# Altium schematic sheet LED1_2.SchDoc
size A2
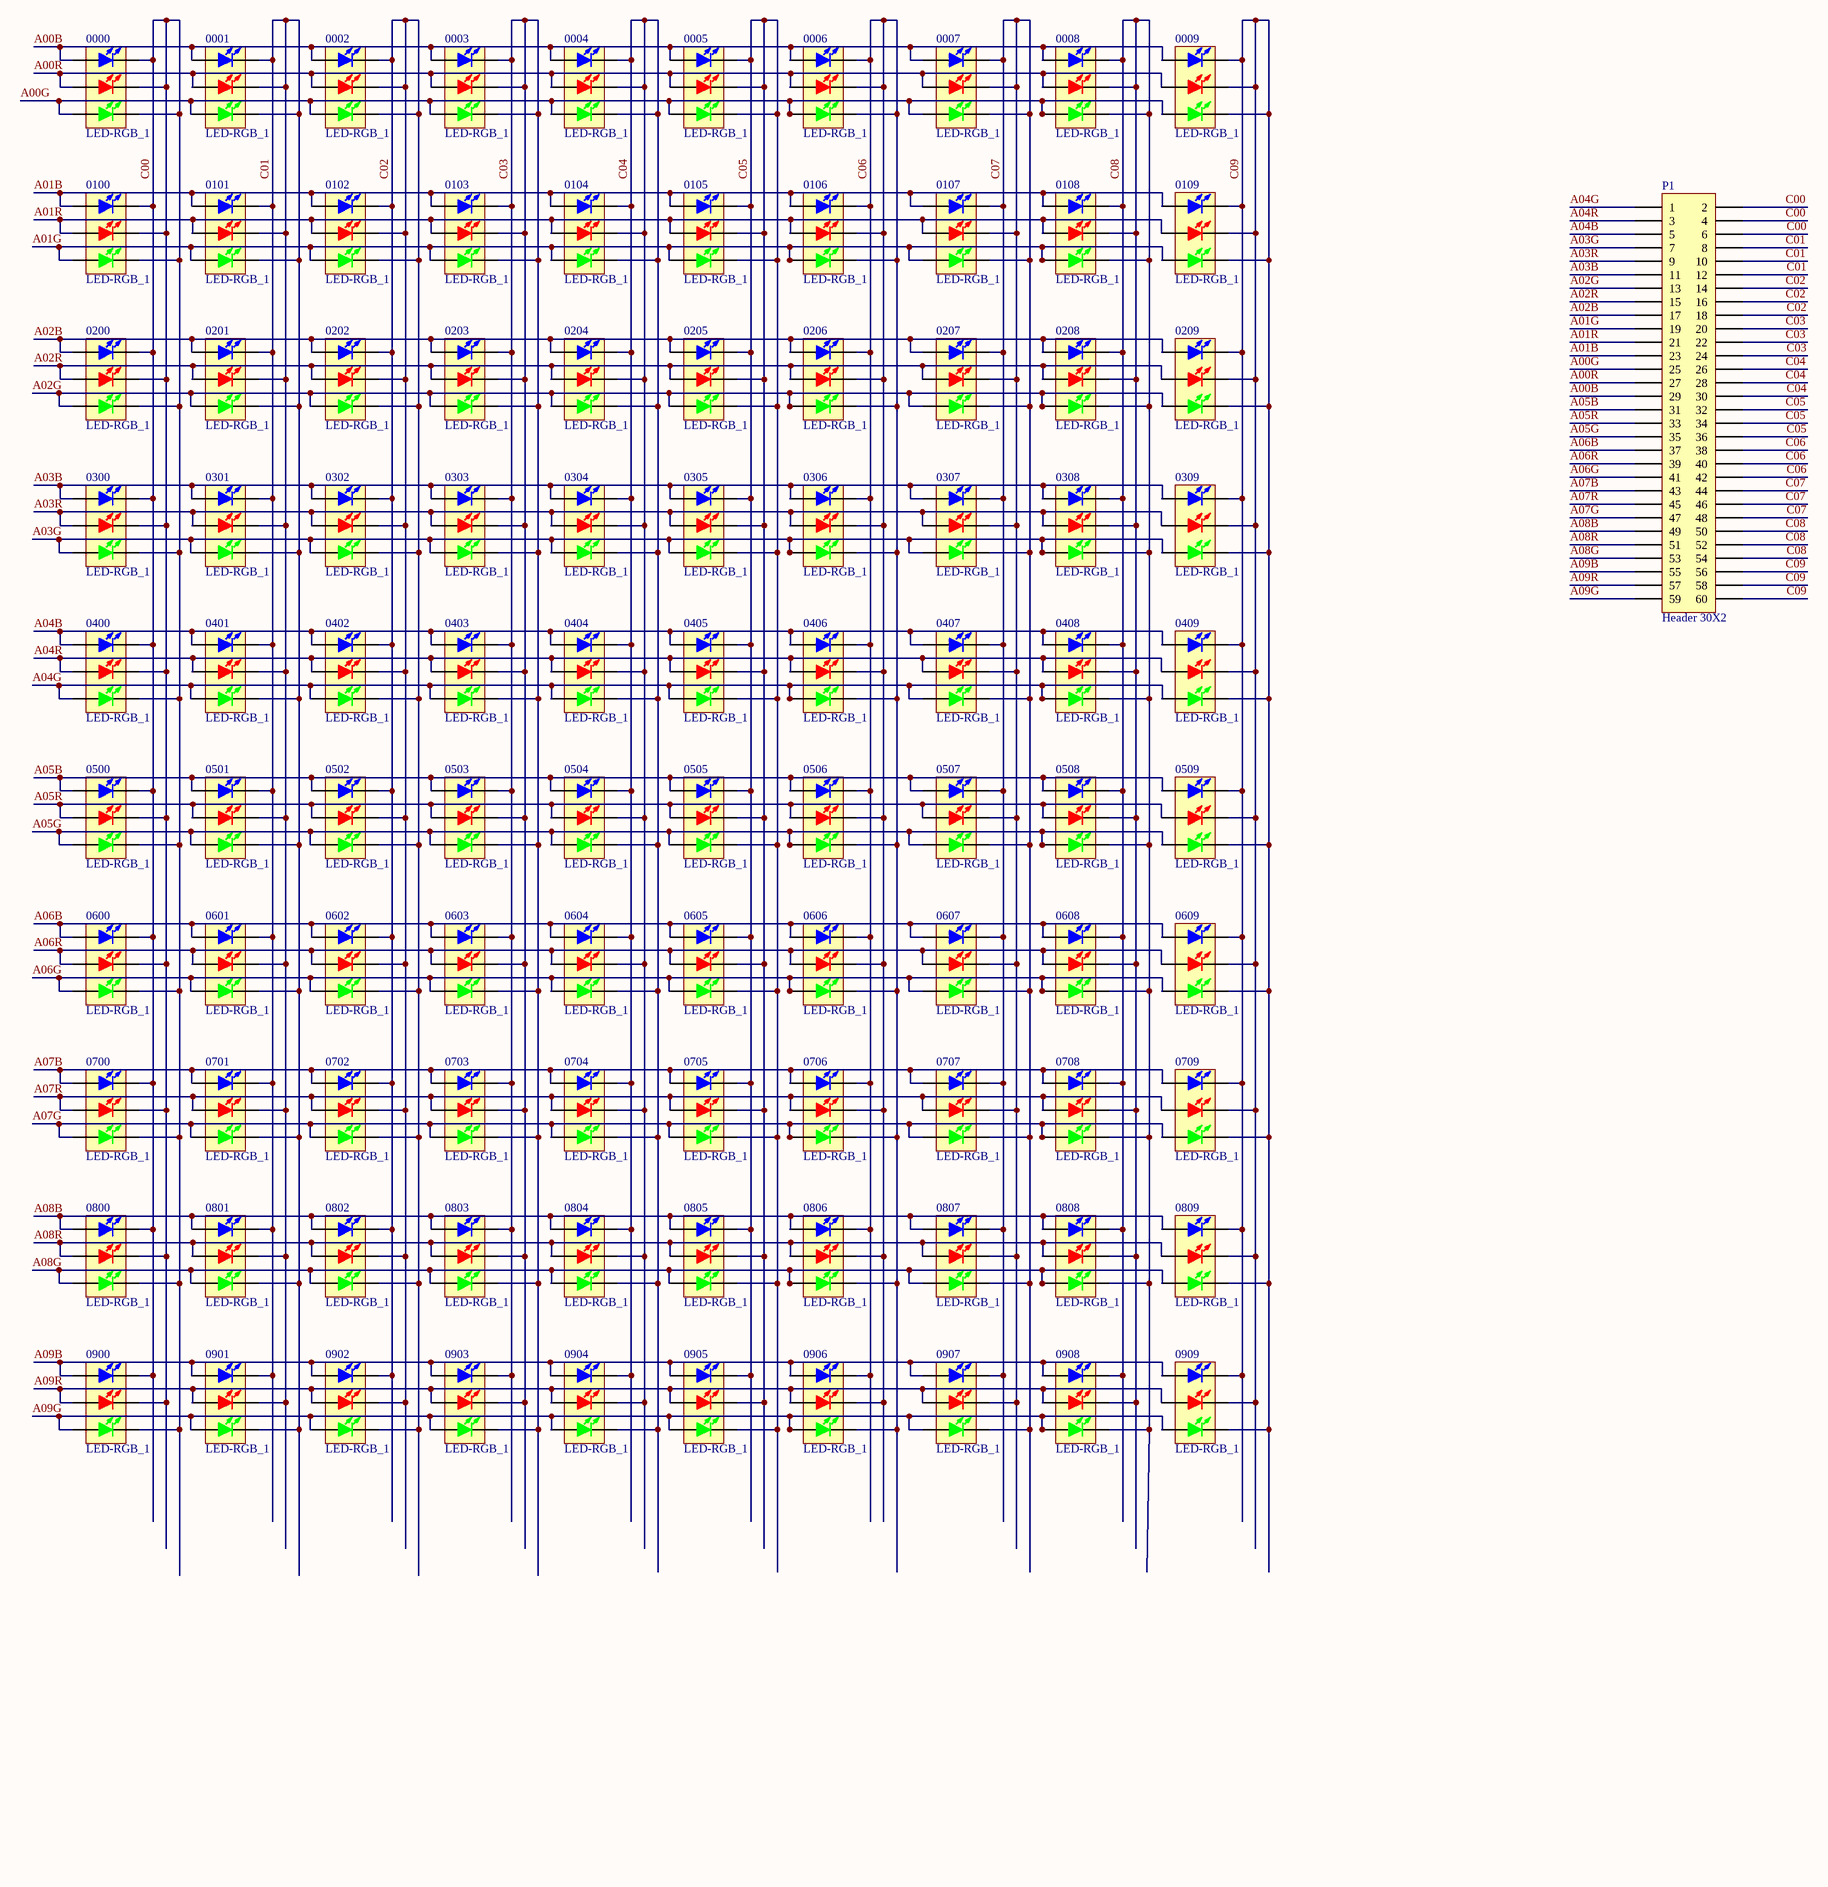
[diagram p0: LED1_2.SchDoc]

## Parts
0000  LED-RGB_1  [LED 5050]
0001  LED-RGB_1  [LED 5050]
0002  LED-RGB_1  [LED 5050]
0003  LED-RGB_1  [LED 5050]
0004  LED-RGB_1  [LED 5050]
0005  LED-RGB_1  [LED 5050]
0006  LED-RGB_1  [LED 5050]
0007  LED-RGB_1  [LED 5050]
0008  LED-RGB_1  [LED 5050]
0009  LED-RGB_1  [LED 5050]
0100  LED-RGB_1  [LED 5050]
0101  LED-RGB_1  [LED 5050]
0102  LED-RGB_1  [LED 5050]
0103  LED-RGB_1  [LED 5050]
0104  LED-RGB_1  [LED 5050]
0105  LED-RGB_1  [LED 5050]
0106  LED-RGB_1  [LED 5050]
0107  LED-RGB_1  [LED 5050]
0108  LED-RGB_1  [LED 5050]
0109  LED-RGB_1  [LED 5050]
0200  LED-RGB_1  [LED 5050]
0201  LED-RGB_1  [LED 5050]
0202  LED-RGB_1  [LED 5050]
0203  LED-RGB_1  [LED 5050]
0204  LED-RGB_1  [LED 5050]
0205  LED-RGB_1  [LED 5050]
0206  LED-RGB_1  [LED 5050]
0207  LED-RGB_1  [LED 5050]
0208  LED-RGB_1  [LED 5050]
0209  LED-RGB_1  [LED 5050]
0300  LED-RGB_1  [LED 5050]
0301  LED-RGB_1  [LED 5050]
0302  LED-RGB_1  [LED 5050]
0303  LED-RGB_1  [LED 5050]
0304  LED-RGB_1  [LED 5050]
0305  LED-RGB_1  [LED 5050]
0306  LED-RGB_1  [LED 5050]
0307  LED-RGB_1  [LED 5050]
0308  LED-RGB_1  [LED 5050]
0309  LED-RGB_1  [LED 5050]
0400  LED-RGB_1  [LED 5050]
0401  LED-RGB_1  [LED 5050]
0402  LED-RGB_1  [LED 5050]
0403  LED-RGB_1  [LED 5050]
0404  LED-RGB_1  [LED 5050]
0405  LED-RGB_1  [LED 5050]
0406  LED-RGB_1  [LED 5050]
0407  LED-RGB_1  [LED 5050]
0408  LED-RGB_1  [LED 5050]
0409  LED-RGB_1  [LED 5050]
0500  LED-RGB_1  [LED 5050]
0501  LED-RGB_1  [LED 5050]
0502  LED-RGB_1  [LED 5050]
0503  LED-RGB_1  [LED 5050]
0504  LED-RGB_1  [LED 5050]
0505  LED-RGB_1  [LED 5050]
0506  LED-RGB_1  [LED 5050]
0507  LED-RGB_1  [LED 5050]
0508  LED-RGB_1  [LED 5050]
0509  LED-RGB_1  [LED 5050]
0600  LED-RGB_1  [LED 5050]
0601  LED-RGB_1  [LED 5050]
0602  LED-RGB_1  [LED 5050]
0603  LED-RGB_1  [LED 5050]
0604  LED-RGB_1  [LED 5050]
0605  LED-RGB_1  [LED 5050]
0606  LED-RGB_1  [LED 5050]
0607  LED-RGB_1  [LED 5050]
0608  LED-RGB_1  [LED 5050]
0609  LED-RGB_1  [LED 5050]
0700  LED-RGB_1  [LED 5050]
0701  LED-RGB_1  [LED 5050]
0702  LED-RGB_1  [LED 5050]
0703  LED-RGB_1  [LED 5050]
0704  LED-RGB_1  [LED 5050]
0705  LED-RGB_1  [LED 5050]
0706  LED-RGB_1  [LED 5050]
0707  LED-RGB_1  [LED 5050]
0708  LED-RGB_1  [LED 5050]
0709  LED-RGB_1  [LED 5050]
0800  LED-RGB_1  [LED 5050]
0801  LED-RGB_1  [LED 5050]
0802  LED-RGB_1  [LED 5050]
0803  LED-RGB_1  [LED 5050]
0804  LED-RGB_1  [LED 5050]
0805  LED-RGB_1  [LED 5050]
0806  LED-RGB_1  [LED 5050]
0807  LED-RGB_1  [LED 5050]
0808  LED-RGB_1  [LED 5050]
0809  LED-RGB_1  [LED 5050]
0900  LED-RGB_1  [LED 5050]
0901  LED-RGB_1  [LED 5050]
0902  LED-RGB_1  [LED 5050]
0903  LED-RGB_1  [LED 5050]
0904  LED-RGB_1  [LED 5050]
0905  LED-RGB_1  [LED 5050]
0906  LED-RGB_1  [LED 5050]
0907  LED-RGB_1  [LED 5050]
0908  LED-RGB_1  [LED 5050]
0909  LED-RGB_1  [LED 5050]
P1  Header 30X2  [HDR2X30]

## Nets
A00B: 0000.1(BULE_A) 0001.1(BULE_A) 0002.1(BULE_A) 0003.1(BULE_A) 0004.1(BULE_A) 0005.1(BULE_A) 0006.1(BULE_A) 0007.1(BULE_A) 0008.1(BULE_A) 0009.1(BULE_A) P1.29
A00G: 0000.5(GREEN_A) 0001.5(GREEN_A) 0002.5(GREEN_A) 0003.5(GREEN_A) 0004.5(GREEN_A) 0005.5(GREEN_A) 0006.5(GREEN_A) 0007.5(GREEN_A) 0008.5(GREEN_A) 0009.5(GREEN_A) P1.25
A00R: 0000.3(RED_A) 0001.3(RED_A) 0002.3(RED_A) 0003.3(RED_A) 0004.3(RED_A) 0005.3(RED_A) 0006.3(RED_A) 0007.3(RED_A) 0008.3(RED_A) 0009.3(RED_A) P1.27
A01B: 0100.1(BULE_A) 0101.1(BULE_A) 0102.1(BULE_A) 0103.1(BULE_A) 0104.1(BULE_A) 0105.1(BULE_A) 0106.1(BULE_A) 0107.1(BULE_A) 0108.1(BULE_A) 0109.1(BULE_A) P1.23
A01G: 0100.5(GREEN_A) 0101.5(GREEN_A) 0102.5(GREEN_A) 0103.5(GREEN_A) 0104.5(GREEN_A) 0105.5(GREEN_A) 0106.5(GREEN_A) 0107.5(GREEN_A) 0108.5(GREEN_A) 0109.5(GREEN_A) P1.19
A01R: 0100.3(RED_A) 0101.3(RED_A) 0102.3(RED_A) 0103.3(RED_A) 0104.3(RED_A) 0105.3(RED_A) 0106.3(RED_A) 0107.3(RED_A) 0108.3(RED_A) 0109.3(RED_A) P1.21
A02B: 0200.1(BULE_A) 0201.1(BULE_A) 0202.1(BULE_A) 0203.1(BULE_A) 0204.1(BULE_A) 0205.1(BULE_A) 0206.1(BULE_A) 0207.1(BULE_A) 0208.1(BULE_A) 0209.1(BULE_A) P1.17
A02G: 0200.5(GREEN_A) 0201.5(GREEN_A) 0202.5(GREEN_A) 0203.5(GREEN_A) 0204.5(GREEN_A) 0205.5(GREEN_A) 0206.5(GREEN_A) 0207.5(GREEN_A) 0208.5(GREEN_A) 0209.5(GREEN_A) P1.13
A02R: 0200.3(RED_A) 0201.3(RED_A) 0202.3(RED_A) 0203.3(RED_A) 0204.3(RED_A) 0205.3(RED_A) 0206.3(RED_A) 0207.3(RED_A) 0208.3(RED_A) 0209.3(RED_A) P1.15
A03B: 0300.1(BULE_A) 0301.1(BULE_A) 0302.1(BULE_A) 0303.1(BULE_A) 0304.1(BULE_A) 0305.1(BULE_A) 0306.1(BULE_A) 0307.1(BULE_A) 0308.1(BULE_A) 0309.1(BULE_A) P1.11
A03G: 0300.5(GREEN_A) 0301.5(GREEN_A) 0302.5(GREEN_A) 0303.5(GREEN_A) 0304.5(GREEN_A) 0305.5(GREEN_A) 0306.5(GREEN_A) 0307.5(GREEN_A) 0308.5(GREEN_A) 0309.5(GREEN_A) P1.7
A03R: 0300.3(RED_A) 0301.3(RED_A) 0302.3(RED_A) 0303.3(RED_A) 0304.3(RED_A) 0305.3(RED_A) 0306.3(RED_A) 0307.3(RED_A) 0308.3(RED_A) 0309.3(RED_A) P1.9
A04B: 0400.1(BULE_A) 0401.1(BULE_A) 0402.1(BULE_A) 0403.1(BULE_A) 0404.1(BULE_A) 0405.1(BULE_A) 0406.1(BULE_A) 0407.1(BULE_A) 0408.1(BULE_A) 0409.1(BULE_A) P1.5
A04G: 0400.5(GREEN_A) 0401.5(GREEN_A) 0402.5(GREEN_A) 0403.5(GREEN_A) 0404.5(GREEN_A) 0405.5(GREEN_A) 0406.5(GREEN_A) 0407.5(GREEN_A) 0408.5(GREEN_A) 0409.5(GREEN_A) P1.1
A04R: 0400.3(RED_A) 0401.3(RED_A) 0402.3(RED_A) 0403.3(RED_A) 0404.3(RED_A) 0405.3(RED_A) 0406.3(RED_A) 0407.3(RED_A) 0408.3(RED_A) 0409.3(RED_A) P1.3
A05B: 0500.1(BULE_A) 0501.1(BULE_A) 0502.1(BULE_A) 0503.1(BULE_A) 0504.1(BULE_A) 0505.1(BULE_A) 0506.1(BULE_A) 0507.1(BULE_A) 0508.1(BULE_A) 0509.1(BULE_A) P1.31
A05G: 0500.5(GREEN_A) 0501.5(GREEN_A) 0502.5(GREEN_A) 0503.5(GREEN_A) 0504.5(GREEN_A) 0505.5(GREEN_A) 0506.5(GREEN_A) 0507.5(GREEN_A) 0508.5(GREEN_A) 0509.5(GREEN_A) P1.35
A05R: 0500.3(RED_A) 0501.3(RED_A) 0502.3(RED_A) 0503.3(RED_A) 0504.3(RED_A) 0505.3(RED_A) 0506.3(RED_A) 0507.3(RED_A) 0508.3(RED_A) 0509.3(RED_A) P1.33
A06B: 0600.1(BULE_A) 0601.1(BULE_A) 0602.1(BULE_A) 0603.1(BULE_A) 0604.1(BULE_A) 0605.1(BULE_A) 0606.1(BULE_A) 0607.1(BULE_A) 0608.1(BULE_A) 0609.1(BULE_A) P1.37
A06G: 0600.5(GREEN_A) 0601.5(GREEN_A) 0602.5(GREEN_A) 0603.5(GREEN_A) 0604.5(GREEN_A) 0605.5(GREEN_A) 0606.5(GREEN_A) 0607.5(GREEN_A) 0608.5(GREEN_A) 0609.5(GREEN_A) P1.41
A06R: 0600.3(RED_A) 0601.3(RED_A) 0602.3(RED_A) 0603.3(RED_A) 0604.3(RED_A) 0605.3(RED_A) 0606.3(RED_A) 0607.3(RED_A) 0608.3(RED_A) 0609.3(RED_A) P1.39
A07B: 0700.1(BULE_A) 0701.1(BULE_A) 0702.1(BULE_A) 0703.1(BULE_A) 0704.1(BULE_A) 0705.1(BULE_A) 0706.1(BULE_A) 0707.1(BULE_A) 0708.1(BULE_A) 0709.1(BULE_A) P1.43
A07G: 0700.5(GREEN_A) 0701.5(GREEN_A) 0702.5(GREEN_A) 0703.5(GREEN_A) 0704.5(GREEN_A) 0705.5(GREEN_A) 0706.5(GREEN_A) 0707.5(GREEN_A) 0708.5(GREEN_A) 0709.5(GREEN_A) P1.47
A07R: 0700.3(RED_A) 0701.3(RED_A) 0702.3(RED_A) 0703.3(RED_A) 0704.3(RED_A) 0705.3(RED_A) 0706.3(RED_A) 0707.3(RED_A) 0708.3(RED_A) 0709.3(RED_A) P1.45
A08B: 0800.1(BULE_A) 0801.1(BULE_A) 0802.1(BULE_A) 0803.1(BULE_A) 0804.1(BULE_A) 0805.1(BULE_A) 0806.1(BULE_A) 0807.1(BULE_A) 0808.1(BULE_A) 0809.1(BULE_A) P1.49
A08G: 0800.5(GREEN_A) 0801.5(GREEN_A) 0802.5(GREEN_A) 0803.5(GREEN_A) 0804.5(GREEN_A) 0805.5(GREEN_A) 0806.5(GREEN_A) 0807.5(GREEN_A) 0808.5(GREEN_A) 0809.5(GREEN_A) P1.53
A08R: 0800.3(RED_A) 0801.3(RED_A) 0802.3(RED_A) 0803.3(RED_A) 0804.3(RED_A) 0805.3(RED_A) 0806.3(RED_A) 0807.3(RED_A) 0808.3(RED_A) 0809.3(RED_A) P1.51
A09B: 0900.1(BULE_A) 0901.1(BULE_A) 0902.1(BULE_A) 0903.1(BULE_A) 0904.1(BULE_A) 0905.1(BULE_A) 0906.1(BULE_A) 0907.1(BULE_A) 0908.1(BULE_A) 0909.1(BULE_A) P1.55
A09G: 0900.5(GREEN_A) 0901.5(GREEN_A) 0902.5(GREEN_A) 0903.5(GREEN_A) 0904.5(GREEN_A) 0905.5(GREEN_A) 0906.5(GREEN_A) 0907.5(GREEN_A) 0908.5(GREEN_A) 0909.5(GREEN_A) P1.59
A09R: 0900.3(RED_A) 0901.3(RED_A) 0902.3(RED_A) 0903.3(RED_A) 0904.3(RED_A) 0905.3(RED_A) 0906.3(RED_A) 0907.3(RED_A) 0908.3(RED_A) 0909.3(RED_A) P1.57
C00: 0000.2(BULE_K) 0000.4(RED_K) 0000.6(GREEN_K) 0100.2(BULE_K) 0100.4(RED_K) 0100.6(GREEN_K) 0200.2(BULE_K) 0200.4(RED_K) 0200.6(GREEN_K) 0300.2(BULE_K) 0300.4(RED_K) 0300.6(GREEN_K) 0400.2(BULE_K) 0400.4(RED_K) 0400.6(GREEN_K) 0500.2(BULE_K) 0500.4(RED_K) 0500.6(GREEN_K) 0600.2(BULE_K) 0600.4(RED_K) 0600.6(GREEN_K) 0700.2(BULE_K) 0700.4(RED_K) 0700.6(GREEN_K) 0800.2(BULE_K) 0800.4(RED_K) 0800.6(GREEN_K) 0900.2(BULE_K) 0900.4(RED_K) 0900.6(GREEN_K) P1.2 P1.4 P1.6
C01: 0001.2(BULE_K) 0001.4(RED_K) 0001.6(GREEN_K) 0101.2(BULE_K) 0101.4(RED_K) 0101.6(GREEN_K) 0201.2(BULE_K) 0201.4(RED_K) 0201.6(GREEN_K) 0301.2(BULE_K) 0301.4(RED_K) 0301.6(GREEN_K) 0401.2(BULE_K) 0401.4(RED_K) 0401.6(GREEN_K) 0501.2(BULE_K) 0501.4(RED_K) 0501.6(GREEN_K) 0601.2(BULE_K) 0601.4(RED_K) 0601.6(GREEN_K) 0701.2(BULE_K) 0701.4(RED_K) 0701.6(GREEN_K) 0801.2(BULE_K) 0801.4(RED_K) 0801.6(GREEN_K) 0901.2(BULE_K) 0901.4(RED_K) 0901.6(GREEN_K) P1.8 P1.10 P1.12
C02: 0002.2(BULE_K) 0002.4(RED_K) 0002.6(GREEN_K) 0102.2(BULE_K) 0102.4(RED_K) 0102.6(GREEN_K) 0202.2(BULE_K) 0202.4(RED_K) 0202.6(GREEN_K) 0302.2(BULE_K) 0302.4(RED_K) 0302.6(GREEN_K) 0402.2(BULE_K) 0402.4(RED_K) 0402.6(GREEN_K) 0502.2(BULE_K) 0502.4(RED_K) 0502.6(GREEN_K) 0602.2(BULE_K) 0602.4(RED_K) 0602.6(GREEN_K) 0702.2(BULE_K) 0702.4(RED_K) 0702.6(GREEN_K) 0802.2(BULE_K) 0802.4(RED_K) 0802.6(GREEN_K) 0902.2(BULE_K) 0902.4(RED_K) 0902.6(GREEN_K) P1.14 P1.16 P1.18
C03: 0003.2(BULE_K) 0003.4(RED_K) 0003.6(GREEN_K) 0103.2(BULE_K) 0103.4(RED_K) 0103.6(GREEN_K) 0203.2(BULE_K) 0203.4(RED_K) 0203.6(GREEN_K) 0303.2(BULE_K) 0303.4(RED_K) 0303.6(GREEN_K) 0403.2(BULE_K) 0403.4(RED_K) 0403.6(GREEN_K) 0503.2(BULE_K) 0503.4(RED_K) 0503.6(GREEN_K) 0603.2(BULE_K) 0603.4(RED_K) 0603.6(GREEN_K) 0703.2(BULE_K) 0703.4(RED_K) 0703.6(GREEN_K) 0803.2(BULE_K) 0803.4(RED_K) 0803.6(GREEN_K) 0903.2(BULE_K) 0903.4(RED_K) 0903.6(GREEN_K) P1.20 P1.22 P1.24
C04: 0004.2(BULE_K) 0004.4(RED_K) 0004.6(GREEN_K) 0104.2(BULE_K) 0104.4(RED_K) 0104.6(GREEN_K) 0204.2(BULE_K) 0204.4(RED_K) 0204.6(GREEN_K) 0304.2(BULE_K) 0304.4(RED_K) 0304.6(GREEN_K) 0404.2(BULE_K) 0404.4(RED_K) 0404.6(GREEN_K) 0504.2(BULE_K) 0504.4(RED_K) 0504.6(GREEN_K) 0604.2(BULE_K) 0604.4(RED_K) 0604.6(GREEN_K) 0704.2(BULE_K) 0704.4(RED_K) 0704.6(GREEN_K) 0804.2(BULE_K) 0804.4(RED_K) 0804.6(GREEN_K) 0904.2(BULE_K) 0904.4(RED_K) 0904.6(GREEN_K) P1.26 P1.28 P1.30
C05: 0005.2(BULE_K) 0005.4(RED_K) 0005.6(GREEN_K) 0105.2(BULE_K) 0105.4(RED_K) 0105.6(GREEN_K) 0205.2(BULE_K) 0205.4(RED_K) 0205.6(GREEN_K) 0305.2(BULE_K) 0305.4(RED_K) 0305.6(GREEN_K) 0405.2(BULE_K) 0405.4(RED_K) 0405.6(GREEN_K) 0505.2(BULE_K) 0505.4(RED_K) 0505.6(GREEN_K) 0605.2(BULE_K) 0605.4(RED_K) 0605.6(GREEN_K) 0705.2(BULE_K) 0705.4(RED_K) 0705.6(GREEN_K) 0805.2(BULE_K) 0805.4(RED_K) 0805.6(GREEN_K) 0905.2(BULE_K) 0905.4(RED_K) 0905.6(GREEN_K) P1.32 P1.34 P1.36
C06: 0006.2(BULE_K) 0006.4(RED_K) 0006.6(GREEN_K) 0106.2(BULE_K) 0106.4(RED_K) 0106.6(GREEN_K) 0206.2(BULE_K) 0206.4(RED_K) 0206.6(GREEN_K) 0306.2(BULE_K) 0306.4(RED_K) 0306.6(GREEN_K) 0406.2(BULE_K) 0406.4(RED_K) 0406.6(GREEN_K) 0506.2(BULE_K) 0506.4(RED_K) 0506.6(GREEN_K) 0606.2(BULE_K) 0606.4(RED_K) 0606.6(GREEN_K) 0706.2(BULE_K) 0706.4(RED_K) 0706.6(GREEN_K) 0806.2(BULE_K) 0806.4(RED_K) 0806.6(GREEN_K) 0906.2(BULE_K) 0906.4(RED_K) 0906.6(GREEN_K) P1.38 P1.40 P1.42
C07: 0007.2(BULE_K) 0007.4(RED_K) 0007.6(GREEN_K) 0107.2(BULE_K) 0107.4(RED_K) 0107.6(GREEN_K) 0207.2(BULE_K) 0207.4(RED_K) 0207.6(GREEN_K) 0307.2(BULE_K) 0307.4(RED_K) 0307.6(GREEN_K) 0407.2(BULE_K) 0407.4(RED_K) 0407.6(GREEN_K) 0507.2(BULE_K) 0507.4(RED_K) 0507.6(GREEN_K) 0607.2(BULE_K) 0607.4(RED_K) 0607.6(GREEN_K) 0707.2(BULE_K) 0707.4(RED_K) 0707.6(GREEN_K) 0807.2(BULE_K) 0807.4(RED_K) 0807.6(GREEN_K) 0907.2(BULE_K) 0907.4(RED_K) 0907.6(GREEN_K) P1.44 P1.46 P1.48
C08: 0008.2(BULE_K) 0008.4(RED_K) 0008.6(GREEN_K) 0108.2(BULE_K) 0108.4(RED_K) 0108.6(GREEN_K) 0208.2(BULE_K) 0208.4(RED_K) 0208.6(GREEN_K) 0308.2(BULE_K) 0308.4(RED_K) 0308.6(GREEN_K) 0408.2(BULE_K) 0408.4(RED_K) 0408.6(GREEN_K) 0508.2(BULE_K) 0508.4(RED_K) 0508.6(GREEN_K) 0608.2(BULE_K) 0608.4(RED_K) 0608.6(GREEN_K) 0708.2(BULE_K) 0708.4(RED_K) 0708.6(GREEN_K) 0808.2(BULE_K) 0808.4(RED_K) 0808.6(GREEN_K) 0908.2(BULE_K) 0908.4(RED_K) 0908.6(GREEN_K) P1.50 P1.52 P1.54
C09: 0009.2(BULE_K) 0009.4(RED_K) 0009.6(GREEN_K) 0109.2(BULE_K) 0109.4(RED_K) 0109.6(GREEN_K) 0209.2(BULE_K) 0209.4(RED_K) 0209.6(GREEN_K) 0309.2(BULE_K) 0309.4(RED_K) 0309.6(GREEN_K) 0409.2(BULE_K) 0409.4(RED_K) 0409.6(GREEN_K) 0509.2(BULE_K) 0509.4(RED_K) 0509.6(GREEN_K) 0609.2(BULE_K) 0609.4(RED_K) 0609.6(GREEN_K) 0709.2(BULE_K) 0709.4(RED_K) 0709.6(GREEN_K) 0809.2(BULE_K) 0809.4(RED_K) 0809.6(GREEN_K) 0909.2(BULE_K) 0909.4(RED_K) 0909.6(GREEN_K) P1.56 P1.58 P1.60

## Library data of the parts
0000 0001 0002 0003 0004 0005 0006 0007 0008 0009 0100 0101 0102 0103 0104 0105 0106 0107 0108 0109 0200 0201 0202 0203 0204 0205 0206 0207 0208 0209 0300 0301 0302 0303 0304 0305 0306 0307 0308 0309 0400 0401 0402 0403 0404 0405 0406 0407 0408 0409 0500 0501 0502 0503 0504 0505 0506 0507 0508 0509 0600 0601 0602 0603 0604 0605 0606 0607 0608 0609 0700 0701 0702 0703 0704 0705 0706 0707 0708 0709 0800 0801 0802 0803 0804 0805 0806 0807 0808 0809 0900 0901 0902 0903 0904 0905 0906 0907 0908 0909 = LED-RGB_1: 三基色LED,正负脚相对; 版权归属: 源创客; BOM名称: 三基色LED; 学习资源: www.ooocke.com
P1 = Header 30X2: Header, 30-Pin, Dual row; LatestRevisionDate: 17-Jul-2002; LatestRevisionNote: Re-released for DXP Platform.; Publisher: Altium Limited